# Altium schematic sheet Raspuino.SchDoc
size A
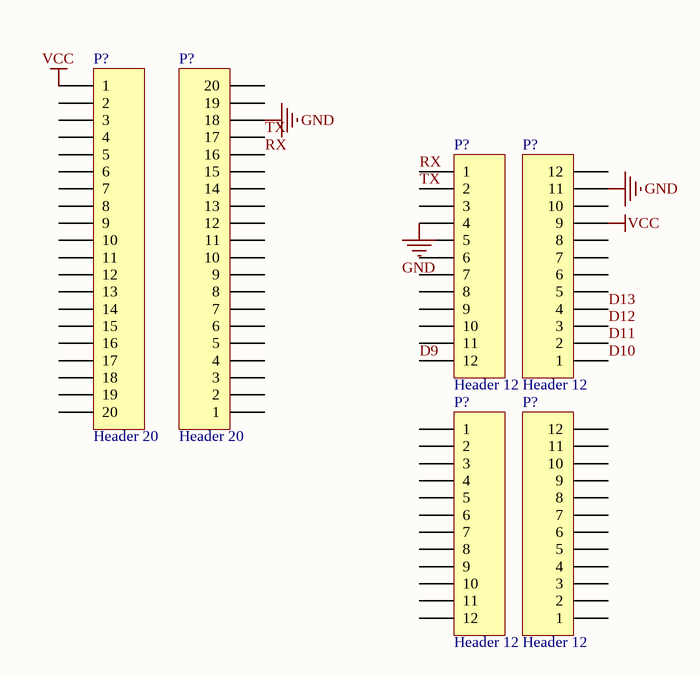
[diagram p0: Raspuino.SchDoc]

## Parts
(Parts that share a designator on the sheet are numbered #1, #2 ... from top to bottom, then left to right.)
P?#1  Header 20  [HDR1X20]
P?#2  Header 12  [HDR1X12]
P?#3  Header 12  [HDR1X12]
P?#4  Header 12  [HDR1X12]
P?#5  Header 20  [HDR1X20]
P?#6  Header 12  [HDR1X12]

## Nets
GND: P?#2.4 P?#3.11 P?#5.18
VCC: P?#1.1 P?#3.9
D9: P?#2.12
D10: P?#3.1
D11: P?#3.2
D12: P?#3.3
D13: P?#3.4
RX: P?#2.1 P?#5.16
TX: P?#2.2 P?#5.17

Not connected (* = marked no-connect by the designer): P?#1 2 3 4 5 6 7 8 9 10 11 12 13 14 15 16 17 18 19 20; P?#2 3 5 6 7 8 9 10 11; P?#3 5 6 7 8 10 12; P?#4 1 2 3 4 5 6 7 8 9 10 11 12; P?#5 1 2 3 4 5 6 7 8 9 10 11 12 13 14 15 19 20; P?#6 1 2 3 4 5 6 7 8 9 10 11 12

## Library data of the parts
P?#1 P?#5 = Header 20: Header, 20-Pin; LatestRevisionDate: 17-Jul-2002; LatestRevisionNote: Re-released for DXP Platform.; Publisher: Altium Limited
P?#2-P?#4 P?#6 = Header 12: Header, 12-Pin; LatestRevisionDate: 17-Jul-2002; LatestRevisionNote: Re-released for DXP Platform.; Publisher: Altium Limited